# Altium schematic sheet Sheet_1_2026-04-19.schdoc
size 208 x 190 mm
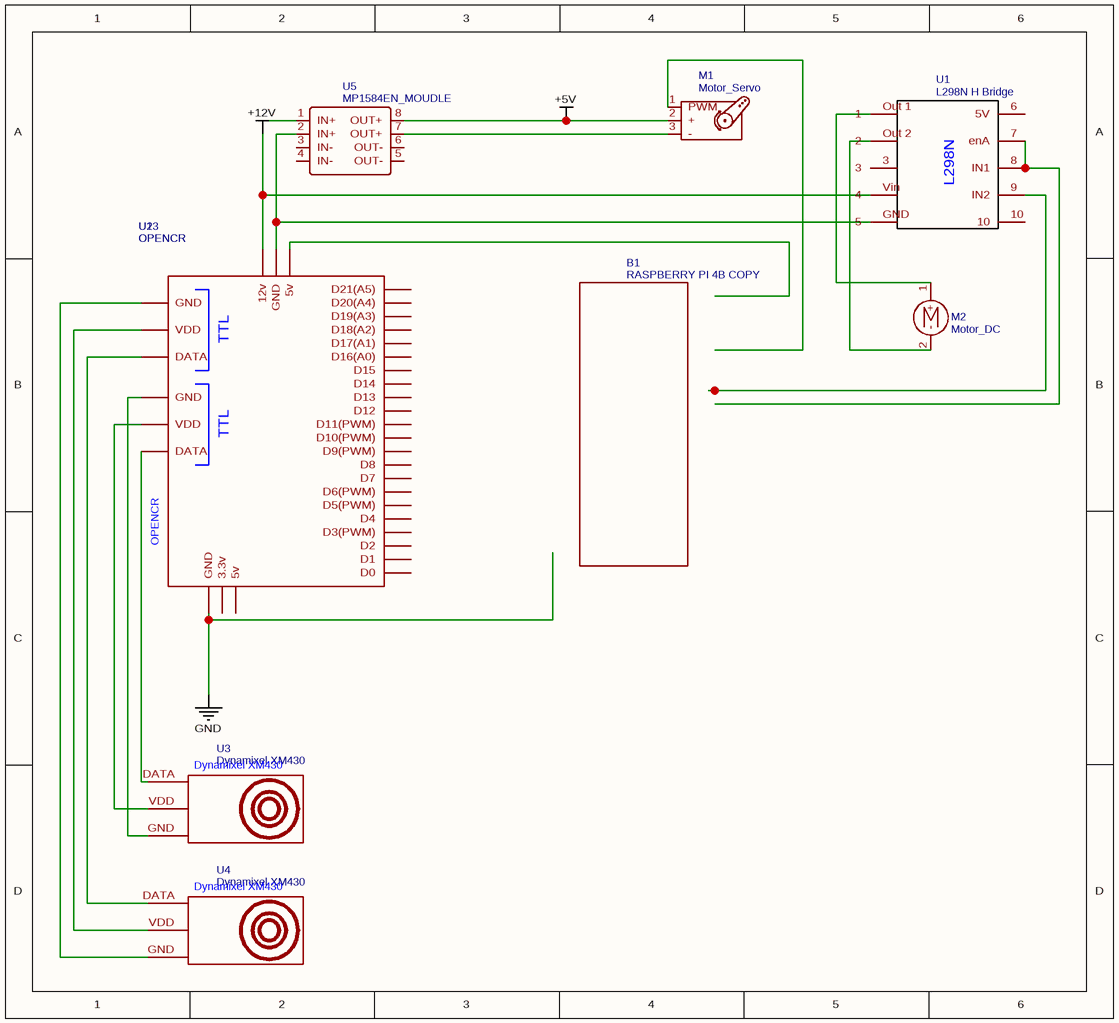
[diagram p0: Sheet_1_2026-04-19.schdoc]

## Parts
B1  RASPBERRY PI 4B COPY  [RASPBERRY_PI_BPLUS_RASPBERRY_PI_B+]
M1  Motor_Servo
M2  Motor_DC  [CONN-TH_2P-P5.08]
U1  L298N H Bridge  [L298N]
U2  OPENCR
U3  Dynamixel XM430
U4  Dynamixel XM430
U5  MP1584EN_MOUDLE  [PWRM-TH_MP1584EN_MOUDLE]

## Nets
+5V: M1.2(+) U5.8(OUT+)
+12V: U2.?30(12v)
GND: U2.?25(GND)
NetM1_3: M1.3(-) U5.7(OUT+)
NetU1_7: U1.7(enA) U1.8(IN1)
NetU2_?26: U2.?26(VDD) U4.VDD
NetU2_?27: U2.?27(GND) U4.GND
NetU2_?28: U2.?28(DATA) U4.DATA
NetU2_?29: U2.?29(GND) U5.2(IN+)
NetU2_?31: U2.?31(DATA) U3.DATA
NetU2_?32: U2.?32(VDD) U3.VDD
NetU2_?33: U2.?33(GND) U3.GND

Not connected (* = marked no-connect by the designer): M1 1(PWM); M2 1(+) 2(-); U1 3 6(5V) 9(IN2) 10 GND(5) Out 1(1) Out 2(2) Vin(4); U2 ?1(D21(A5)) ?2(D20(A4)) ?3(D19(A3)) ?4(D18(A2)) ?5(D17(A1)) ?6(D16(A0)) ?7(D15) ?8(D14) ?9(D13) ?10(D12) ?11(D11(PWM)) ?12(D10(PWM)) ?13(D9(PWM)) ?14(D8) ?15(D7) ?16(D6(PWM)) ?17(D5(PWM)) ?18(D4) ?19(D3(PWM)) ?20(D2) ?21(D1) ?22(D0) ?23(3.3v) ?24(5v) ?34(5v); U5 1(IN+) 3(IN-) 4(IN-) 5(OUT-) 6(OUT-)

## Notes on the sheet
- (in symbol L298N H Bridge) L298N
- (in symbol OPENCR) U13; TTL

## Library data of the parts
B1 = RASPBERRY PI 4B COPY: subpart_no: 2; Contributor: laurenzfoto55; Package Display: No; Manufacturer: Raspberry Pi; Supplier Part: Raspberry Pi 4; link: https://www.raspberrypi.com/products/raspberry-pi-4-model-b/; spicePre: U; spiceSymbolName: Raspberry PI 4B
M1 = Motor_Servo: Contributor: KiCAD; license: https://www.gnu.org/licenses/lgpl-2.1.html; spicePre: M; spiceSymbolName: Motor_Servo
M2 = Motor_DC: Contributor: KiCAD; license: https://www.gnu.org/licenses/lgpl-2.1.html; spicePre: M; spiceSymbolName: Motor_DC
U1 = L298N H Bridge: Contributor: samir42701; spicePre: U; spiceSymbolName: L298N H Bridge
U2 = OPENCR: Contributor: uabas; spicePre: U; spiceSymbolName: OPENCR
U3 U4 = Dynamixel XM430: Contributor: uabas; spicePre: U; spiceSymbolName: Dynamixel XM430
U5 = MP1584EN_MOUDLE: Manufacturer: null; Contributor: lcsc; Supplier: LCSC; Supplier Part: C9900223542; Manufacturer Part: MP1584EN_moudle; spicePre: U; spiceSymbolName: MP1584EN_MOUDLE